# Altium schematic sheet CropSenseMovement_REV03.SchDoc
size A3
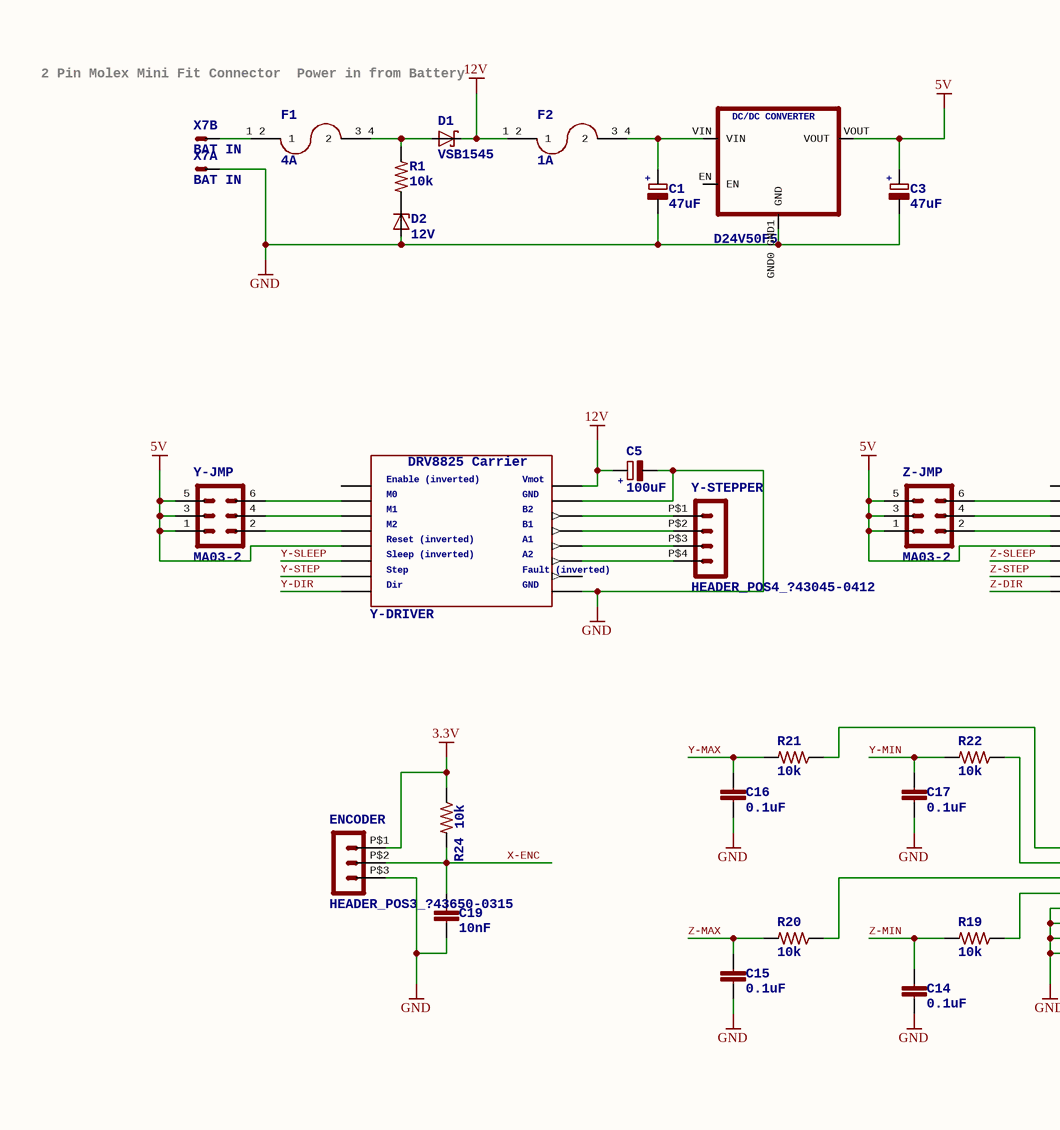
[diagram p0: CropSenseMovement_REV03.SchDoc, left]
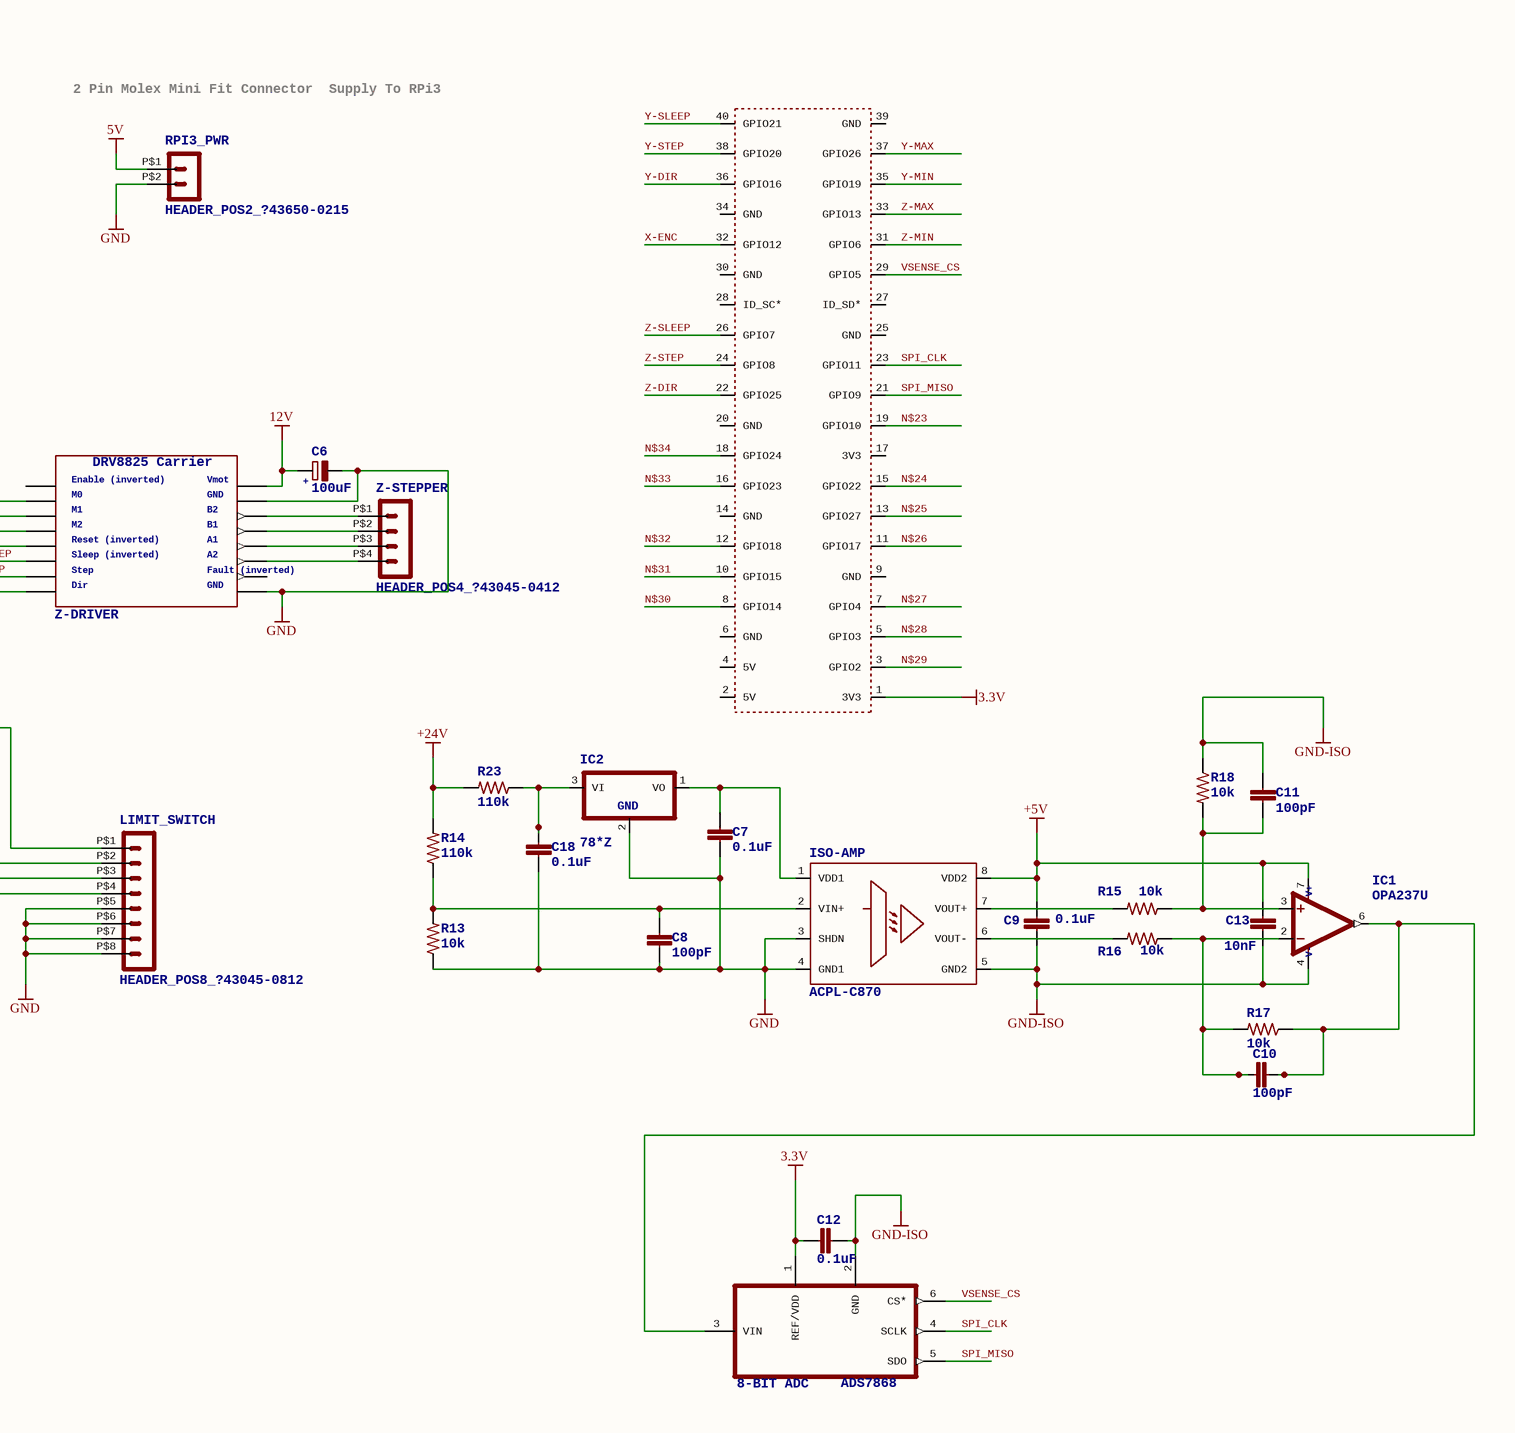
[diagram p1: CropSenseMovement_REV03.SchDoc, right]

## Parts
ADC  ADS7868  8-BITADC: 8-BIT ADC  [SOT-23-6]
C1  47uF  [E2,5-6]
C3  47uF  [E2,5-6]
C5  100uF  [PANASONIC_E]
C6  100uF  [PANASONIC_E]
C7  0.1uF  [C1206K]
C8  100pF  [C1206K]
C9  0.1uF  [C1206K]
C10  100pF  [C1206K]
C11  100pF  [C1206K]
C12  0.1uF  [C1206K]
C13  10nF  [C1206K]
C14  0.1uF  [C1206K]
C15  0.1uF  [C1206K]
C16  0.1uF  [C1206K]
C17  0.1uF  [C1206K]
C18  0.1uF  [C1206K]
C19  10nF  [C1206K]
D1  VSB1545  [P6T15]
D2  12V  [DO35Z10]
ENCODER  HEADER_POS3_?43650-0315  [43650-0315]
F1  4A  [5X20MM_LITTLEFUSE_CARTRIDGE]
F2  1A  [5X20MM_LITTLEFUSE_CARTRIDGE]
IC1  OPA237U  [SO08]
IC2  78*Z  [TO92]
ISO-AMP  ACPL-C870  [SSO-8]
LIMIT_SWITCH  HEADER_POS8_?43045-0812  [43045-0812]
R1  10k  [R1206]
R13  10k  [R1206]
R14  110k  [R1206]
R15  10k  [R1206]
R16  10k  [R1206]
R17  10k  [R1206]
R18  10k  [R1206]
R19  10k  [R1206]
R20  10k  [R1206]
R21  10k  [R1206]
R22  10k  [R1206]
R23  110k  [R1206]
R24  10k  [R1206]
RPI3_PWR  HEADER_POS2_?43650-0215  [43650-0215]
U$2  RPI3_CON  [CONNECTOR]  (value not drawn)
U$3  D24V50F5  DC/DCCONVERTER: DC/DC CONVERTER  [D24VXXFX_BREAKOUT]
X7  BAT IN  [5566-2]  (parts A,B of 2)
Y-DRIVER  Enable(inverted): Enable (inverted)  Reset(inverted): Reset (inverted)  Sleep(inverted): Sleep (inverted)  Fault(inverted): Fault (inverted)  DRV8825Carrier: DRV8825 Carrier  [DRV8825BREAKOUT]  (hidden comment: DRV8825BREAKOUT)
Y-JMP  MA03-2  [MA03-2]
Y-STEPPER  HEADER_POS4_?43045-0412  [43045-0412]
Z-DRIVER  Enable(inverted): Enable (inverted)  Reset(inverted): Reset (inverted)  Sleep(inverted): Sleep (inverted)  Fault(inverted): Fault (inverted)  DRV8825Carrier: DRV8825 Carrier  [DRV8825BREAKOUT]  (hidden comment: DRV8825BREAKOUT)
Z-JMP  MA03-2  [MA03-2]
Z-STEPPER  HEADER_POS4_?43045-0412  [43045-0412]

## Nets
3.3V: ADC.1(REF/VDD) C12.1 ENCODER.P$1 R24.1 U$2.1(3V3)
5V: C3.+ RPI3_PWR.P$1 U$3.VOUT Y-DRIVER.RST Y-JMP.1 Y-JMP.3 Y-JMP.5 Z-DRIVER.RST Z-JMP.1 Z-JMP.3 Z-JMP.5
12V: C5.+ C6.+ D1.C F2.1_2(1) Y-DRIVER.VMOT Z-DRIVER.VMOT
+5V: C9.1 C13.1 IC1.7(V+) ISO-AMP.8(VDD2)
+24V: R14.2 R23.2
GND: C1.- C3.- C5.- C6.- C7.2 C8.2 C14.2 C15.2 C16.2 C17.2 C18.2 C19.2 D2.A ENCODER.P$3 IC2.2(GND) ISO-AMP.3(SHDN) ISO-AMP.4(GND1) LIMIT_SWITCH.P$5 LIMIT_SWITCH.P$6 LIMIT_SWITCH.P$7 LIMIT_SWITCH.P$8 R13.1 RPI3_PWR.P$2 U$3.GND0_GND1(GND) X7.1(S) Y-DRIVER.GND Y-DRIVER.GND0 Z-DRIVER.GND Z-DRIVER.GND0
GND-ISO: ADC.2(GND) C9.2 C11.1 C12.2 C13.2 IC1.4(V-) ISO-AMP.5(GND2) R18.1
N$23: U$2.19(GPIO10)
N$24: U$2.15(GPIO22)
N$25: U$2.13(GPIO27)
N$26: U$2.11(GPIO17)
N$27: U$2.7(GPIO4)
N$28: U$2.5(GPIO3)
N$29: U$2.3(GPIO2)
N$30: U$2.8(GPIO14)
N$31: U$2.10(GPIO15)
N$32: U$2.12(GPIO18)
N$33: U$2.16(GPIO23)
N$34: U$2.18(GPIO24)
SPI_CLK: ADC.4(SCLK) U$2.23(GPIO11)
SPI_MISO: ADC.5(SDO) U$2.21(GPIO9)
VSENSE_CS: ADC.6(CS*) U$2.29(GPIO5)
X-ENC: C19.1 ENCODER.P$2 R24.2 U$2.32(GPIO12)
Y-DIR: U$2.36(GPIO16) Y-DRIVER.DIR
Y-MAX: C16.1 R21.2 U$2.37(GPIO26)
Y-MIN: C17.1 R22.2 U$2.35(GPIO19)
Y-SLEEP: U$2.40(GPIO21) Y-DRIVER.SLP(SLEEP)
Y-STEP: U$2.38(GPIO20) Y-DRIVER.STEP
Z-DIR: U$2.22(GPIO25) Z-DRIVER.DIR
Z-MAX: C15.1 R20.2 U$2.33(GPIO13)
Z-MIN: C14.1 R19.2 U$2.31(GPIO6)
Z-SLEEP: U$2.26(GPIO7) Z-DRIVER.SLP(SLEEP)
Z-STEP: U$2.24(GPIO8) Z-DRIVER.STEP
NetADC_3: ADC.3(VIN) C10.1 IC1.6(OUT) R17.1
NetC1_+: C1.+ F2.3_4(2) U$3.VIN
NetC7_1: C7.1 IC2.1(VO) ISO-AMP.1(VDD1)
NetC8_1: C8.1 ISO-AMP.2(VIN+) R13.2 R14.1
NetC10_2: C10.2 IC1.2(-IN) R16.1 R17.2
NetC11_2: C11.2 IC1.3(+IN) R15.1 R18.2
NetC18_1: C18.1 IC2.3(VI) R23.1
NetD1_A: D1.A F1.3_4(2) R1.1
NetD2_C: D2.C R1.2
NetF1_1 2: F1.1_2(1) X7.2(S)
NetISO-AMP_6: ISO-AMP.6(VOUT-) R16.2
NetISO-AMP_7: ISO-AMP.7(VOUT+) R15.2
NetLIMIT_SWITCH_P$1: LIMIT_SWITCH.P$1 R21.1
NetLIMIT_SWITCH_P$2: LIMIT_SWITCH.P$2 R22.1
NetLIMIT_SWITCH_P$3: LIMIT_SWITCH.P$3 R20.1
NetLIMIT_SWITCH_P$4: LIMIT_SWITCH.P$4 R19.1
NetY-DRIVER_A1: Y-DRIVER.A1 Y-STEPPER.P$3
NetY-DRIVER_A2: Y-DRIVER.A2 Y-STEPPER.P$4
NetY-DRIVER_B1: Y-DRIVER.B1 Y-STEPPER.P$2
NetY-DRIVER_B2: Y-DRIVER.B2 Y-STEPPER.P$1
NetY-DRIVER_M0: Y-DRIVER.M0 Y-JMP.6
NetY-DRIVER_M1: Y-DRIVER.M1 Y-JMP.4
NetY-DRIVER_M2: Y-DRIVER.M2 Y-JMP.2
NetZ-DRIVER_A1: Z-DRIVER.A1 Z-STEPPER.P$3
NetZ-DRIVER_A2: Z-DRIVER.A2 Z-STEPPER.P$4
NetZ-DRIVER_B1: Z-DRIVER.B1 Z-STEPPER.P$2
NetZ-DRIVER_B2: Z-DRIVER.B2 Z-STEPPER.P$1
NetZ-DRIVER_M0: Z-DRIVER.M0 Z-JMP.6
NetZ-DRIVER_M1: Z-DRIVER.M1 Z-JMP.4
NetZ-DRIVER_M2: Z-DRIVER.M2 Z-JMP.2

Not connected (* = marked no-connect by the designer): U$2 2(5V) 4(5V) 6(GND) 9(GND) 14(GND) 17(3V3) 20(GND) 25(GND) 27(ID_SD*) 28(ID_SC*) 30(GND) 34(GND) 39(GND); U$3 EN; Y-DRIVER EN FAULT; Z-DRIVER EN FAULT

## Notes on the sheet
- 2 Pin Molex Mini Fit Connector
  Power in from Battery
- 2 Pin Molex Mini Fit Connector
  Supply To RPi3
- Title
- Size:
- Date:
- A3
- Number:
- Time:
- Revision:
- Sheet
- of
- File:

## Library data of the parts
ADC = ADS7868: ADS7868    8-bit ADC   Datasheet
C1 C3 = CPOL-EUE2.5-6: POLARIZED CAPACITOR, European symbol; +: +
C5 C6 = CPOL-EUE: POLARIZED CAPACITOR, European symbol; +: +
C7-C19 = C-EUC1206K: CAPACITOR, European symbol
D1 = SCHOTTKY-DIODEP6T15: Schottky Diode
D2 = ZENER-DIODEDO35Z10: Z-Diode
ENCODER = HEADER_POS3_?43650-0315: Molex - Micro-Fit 3.0 Series connector,  3.00mm (0.118") pitch header, 3 positions.
F1 F2 = FUSE_5X20_LITTLEFUSE
IC1 = OPA237U: Operational Amplifiers   Single-Supply, MicroAmplifier(TM) Series; MPN: OPA237UA; MF: TEXAS INSTRUMENT CONNECTORS; OC_FARNELL: 1800507; OC_NEWARK: 04M4584; V+: V+; V-: V-
IC2 = 78*Z: Positive VOLTAGE REGULATOR   Source: http://cache.national.com/ds/LM/LM78L05.pdf http://www.fairchildsemi.com/ds/LM/LM7805.pdf; GND: GND
LIMIT_SWITCH = HEADER_POS8_?43045-0812: Molex - Micro-Fit 3.0 Series connector,  3.00mm (0.118") pitch header, 8 positions.
R1 R13-R24 = R-US_R1206: RESISTOR, American symbol
RPI3_PWR = HEADER_POS2_?43650-0215: Molex - Micro-Fit 3.0 Series connector,  3.00mm (0.118") pitch header, 2 positions.
X7 = 5566-2: Mini FIT connector 2 pol   Source: http://www.molex.com; OC_FARNELL: 1822072; OC_NEWARK: unknown
Y-DRIVER Z-DRIVER = DRV8825BREAKOUT: DRV8825 Carrier    Datasheet; GND: GND; M0: M0; M1: M1; M2: M2; Step: Step; Dir: Dir; Vmot: Vmot; B2: B2; B1: B1; A1: A1; A2: A2
Y-JMP Z-JMP = MA03-2: PIN HEADER; OC_FARNELL: unknown; OC_NEWARK: unknown
Y-STEPPER Z-STEPPER = HEADER_POS4_?43045-0412: Molex - Micro-Fit 3.0 Series connector,  3.00mm (0.118") pitch header, 4 positions.